# Altium schematic sheet n-MAX-V1.SchDoc
size A4; PageSetup: Record=PageOptions|CenterHorizontal=True|CenterVertical=True|PrintScale=1.00|XCorrection=1.00|YCorrection=1.00|PrintKind=2|BorderSize=5000000|LeftOffset=0|BottomOffset=0|Orientation=2|PaperLength=1000|PaperWidth=1000|Scale=100|PaperSource=7|PrintQuality=-4|MediaType=1|DitherType=10|PaperKind=A4|PrintScaleMode=1
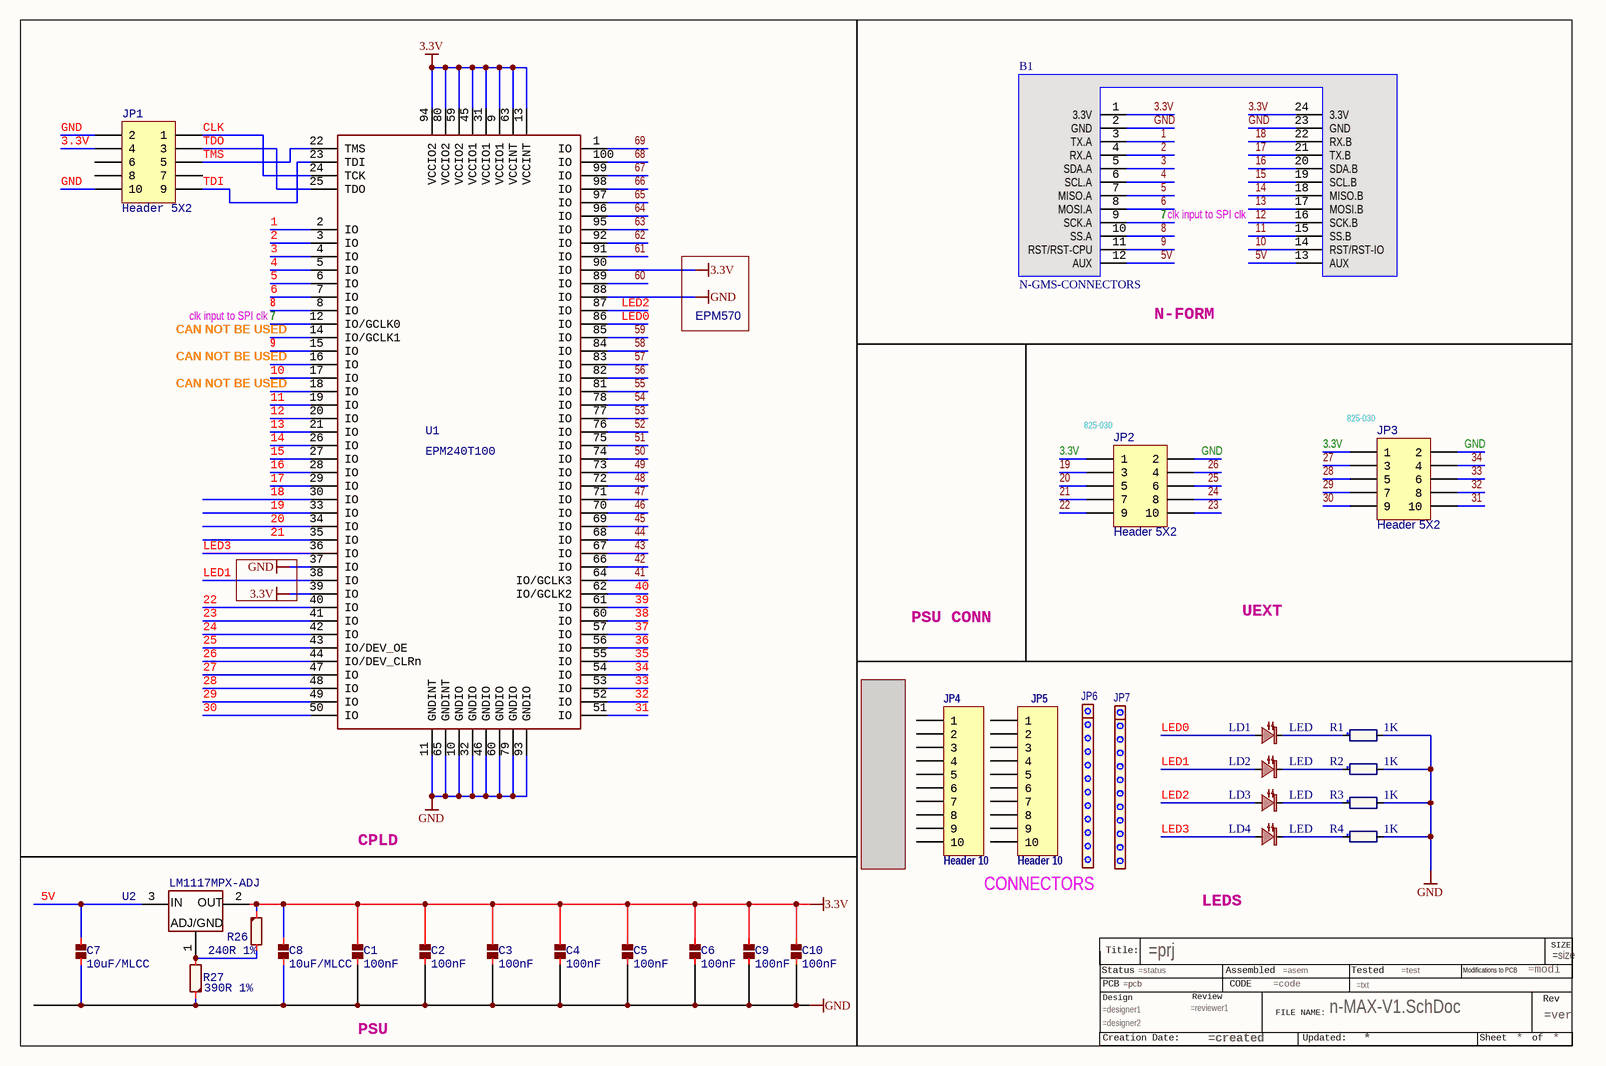
[diagram p0: n-MAX-V1.SchDoc]

## Parts
?*??  FILE_NAME: n-MAX-V1.SchDoc  (hidden comment: TITLEBLOCK3)  (graphical)
B1  N-GMS-CONNECTORS  [N-GMS]
C1  100nF  [0603_CAP]
C2  100nF  [0603_CAP]
C3  100nF  [0603_CAP]
C4  100nF  [0603_CAP]
C5  100nF  [0603_CAP]
C6  100nF  [0603_CAP]
C7  10uF/MLCC  [0603_CAP]
C8  10uF/MLCC  [0603_CAP]
C9  100nF  [0603_CAP]
C10  100nF  [0603_CAP]
JP1  Header 5X2  [ML10-FCI]
JP2  Header 5X2  CODE: 825-030  [ML10-FCI]
JP3  Header 5X2  CODE: 825-030  [ML10-FCI]
JP4  Header 10  [1X10]
JP5  Header 10  [1X10]
JP6  HEADER 9  [1X12-NOSILK]  (value not drawn)
JP7  HEADER 9  [1X12-NOSILK]  (value not drawn)
LD1  LED  [0603_LED_RED]
LD2  LED  [0603_LED_RED]
LD3  LED  [0603_LED_RED]
LD4  LED  [0603_LED_RED]
R1  1K  [0603_res]
R2  1K  [0603_res]
R3  1K  [0603_res]
R4  1K  [0603_res]
R26  240R 1%  [0603_RES]
R27  390R 1%  [0603_RES]
U1  EPM240T100  [TQFP100]
U2  LM1117MPX-ADJ  [SOT-223]

## Nets
3.3V: B1.1(3.3V) B1.24(3.3V) C1.1 C2.1 C3.1 C4.1 C5.1 C6.1 C8.1 C9.1 C10.1 JP1.4 JP2.1 JP3.1 R26.1 U1.9(VCCIO1) U1.13(VCCINT) U1.31(VCCIO1) U1.39(IO) U1.45(VCCIO1) U1.59(VCCIO2) U1.63(VCCINT) U1.80(VCCIO2) U1.90(IO) U1.94(VCCIO2) U2.2(OUT)
GND: B1.2(GND) B1.23(GND) C1.2 C2.2 C3.2 C4.2 C5.2 C6.2 C7.2 C8.2 C9.2 C10.2 JP1.2 JP1.10 JP2.2 JP3.2 R1.2 R2.2 R3.2 R4.2 R27.1 U1.10(GNDIO) U1.11(GNDINT) U1.32(GNDIO) U1.37(IO) U1.46(GNDIO) U1.60(GNDIO) U1.65(GNDINT) U1.79(GNDIO) U1.88(IO) U1.93(GNDIO)
1: B1.3(TX.A) U1.2(IO)
2: B1.4(RX.A) U1.3(IO)
3: B1.5(SDA.A) U1.4(IO)
4: B1.6(SCL.A) U1.5(IO)
5: B1.7(MISO.A) U1.6(IO)
5V: B1.12(AUX) B1.13(AUX) C7.1 U2.3(IN)
6: B1.8(MOSI.A) U1.7(IO)
7: B1.9(SCK.A) U1.12(IO/GCLK0)
8: B1.10(SS.A) U1.8(IO)
9: B1.11(RST/RST-CPU) U1.15(IO)
10: B1.14(RST/RST-IO) U1.17(IO)
11: B1.15(SS.B) U1.19(IO)
12: B1.16(SCK.B) U1.20(IO)
13: B1.17(MOSI.B) U1.21(IO)
14: B1.18(MISO.B) U1.26(IO)
15: B1.19(SCL.B) U1.27(IO)
16: B1.20(SDA.B) U1.28(IO)
17: B1.21(TX.B) U1.29(IO)
18: B1.22(RX.B) U1.30(IO)
19: JP2.3 U1.33(IO)
20: JP2.5 U1.34(IO)
21: JP2.7 U1.35(IO)
22: JP2.9 U1.40(IO)
23: JP2.10 U1.41(IO)
24: JP2.8 U1.42(IO)
25: JP2.6 U1.43(IO/DEV_OE)
26: JP2.4 U1.44(IO/DEV_CLRn)
27: JP3.3 U1.47(IO)
28: JP3.5 U1.48(IO)
29: JP3.7 U1.49(IO)
30: JP3.9 U1.50(IO)
31: JP3.10 U1.51(IO)
32: JP3.8 U1.52(IO)
33: JP3.6 U1.53(IO)
34: JP3.4 U1.54(IO)
35: U1.55(IO)
36: U1.56(IO)
37: U1.57(IO)
38: U1.60(IO)
39: U1.61(IO)
40: U1.62(IO/GCLK2)
41: U1.64(IO/GCLK3)
42: U1.66(IO)
43: U1.67(IO)
44: U1.68(IO)
45: U1.69(IO)
46: U1.70(IO)
47: U1.71(IO)
48: U1.72(IO)
49: U1.73(IO)
50: U1.74(IO)
51: U1.75(IO)
52: U1.76(IO)
53: U1.77(IO)
54: U1.78(IO)
55: U1.81(IO)
56: U1.82(IO)
57: U1.83(IO)
58: U1.84(IO)
59: U1.85(IO)
60: U1.89(IO)
61: U1.91(IO)
62: U1.92(IO)
63: U1.95(IO)
64: U1.96(IO)
65: U1.97(IO)
66: U1.98(IO)
67: U1.99(IO)
68: U1.100(IO)
69: U1.1(IO)
CLK: JP1.1 U1.24(TCK)
LED0: LD1.1(A) U1.86(IO)
LED1: LD2.1(A) U1.38(IO)
LED2: LD3.1(A) U1.87(IO)
LED3: LD4.1(A) U1.36(IO)
TDI: JP1.9 U1.23(TDI)
TDO: JP1.3 U1.25(TDO)
TMS: JP1.5 U1.22(TMS)
NetLD1_2: LD1.2(C) R1.1
NetLD2_2: LD2.2(C) R2.1
NetLD3_2: LD3.2(C) R3.1
NetLD4_2: LD4.2(C) R4.1
NetR26_2: R26.2 R27.2 U2.1(ADJ/GND)

Not connected (* = marked no-connect by the designer): ?*?? ?1; JP1 6 7 8; JP4 1 2 3 4 5 6 7 8 9 10; JP5 1 2 3 4 5 6 7 8 9 10; JP6 1 2 3 4 5 6 7 8 9 10 11 12; JP7 1 2 3 4 5 6 7 8 9 10 11 12; U1 14(IO/GCLK1) 16(IO) 18(IO)

## Notes on the sheet
- (near B1) clk input to SPI clk
- (near U1) clk input to SPI clk
- EPM570
- (near B1) N-FORM
- CAN NOT BE USED
- PSU CONN
- UEXT
- CPLD
- (near JP6) CONNECTORS
- LEDS
- PSU
- (in symbol TITLEBLOCK3) SIZE; Title:; Status; Assembled; Tested; Modifications to PCB; PCB; CODE; Design; Review; Rev; FILE NAME:; Creation Date:; Updated:; Sheet; of

## Library data of the parts
B1 = N-GMS-CONNECTORS: Divider: 1
C1-C6 C9 C10 = C: CAPACITOR; Manufacturer: Kemet; Manufacturer Part Number: C0603C104K5RACAUTO; S.Description: Multilayer Ceramic Capacitors MLCC - SMD/SMT 0.1uF 50volts 10% X7R AUTO; Capacitance: 0.1 uF; S.Footprint: 0603 (1608 metric); Tolerance: 10 %; Type: AEC-Q200; Voltage Rating DC: 50 VDC; Capacitance - pF: 100000 pF; Class: Class 1; Dielectric: X7R; Divider: 1; Supplier 1: Mouser; Supplier Part Number 1: 80-C0603C104K5RAUTO; RoHS: RoHS Compliant; Category: Multilayer Ceramic Capacitors MLCC - SMD/SMT; Stock 1: 388828; Pricing 1: 1=0.094, 10=0.033, 100=0.023, 500=0.019, 1000=0.015, 4000=0.011, 8000=0.009, 48000=0.007 (EUR); Height: -; Length: 1.6 mm; Packaging: Reel; Product: Automotive MLCCs; Series: C0603C; Termination Style: SMD/SMT; Voltage Rating AC: -; Width: 0.8 mm; Brand: Kemet; Capacitance - nF: 100 nF; Case Code - in: 0603; Case Code - mm: 1608; Maximum Operating Temperature: + 125 C; Minimum Operating Temperature: - 55 C; Qualification: AEC-Q200; Standard Pack Qty: 4000; RoHS - Mouser: Y; Minimum Order Quantity: 1; Reeling: True; ComponentLink1URL: http://www.mouser.com/ds/2/212/KEM_C1023_X7R_AUTO_SMD-519505.pdf; ComponentLink1Description: http://www.mouser.com/ds/2/212/KEM_C1023_X7R_AUTO_SMD-519505.pdf
C7 C8 = C: CAPACITOR; Manufacturer: Murata Electronics; Manufacturer Part Number: GRM188R60J106ME47D; S.Description: Multilayer Ceramic Capacitors MLCC - SMD/SMT 0603 10uF 6.3volts X5R 20%; Capacitance: 10 uF; S.Footprint: 0603 (1608 metric); Tolerance: 20 %; Type: General Purpose MLCC; Voltage Rating DC: 6.3 VDC; Dielectric: X5R; Qualification: Commercial; Divider: 1; Supplier 1: Mouser; Supplier Part Number 1: 81-GRM188R60J106ME47; RoHS: RoHS Compliant; Category: Multilayer Ceramic Capacitors MLCC - SMD/SMT; Stock 1: 1017745; Pricing 1: 1=0.141, 10=0.057, 100=0.040, 500=0.033, 1000=0.026, 4000=0.022 (EUR); Height: 0.8 mm; Length: 1.6 mm; Packaging: Reel; Product: General Type MLCCs; Series: GRM; Termination Style: SMD/SMT; Width: 0.8 mm; Brand: Murata Electronics; Case Code - in: 0603; Case Code - mm: 1608; Maximum Operating Temperature: + 85 C; Minimum Operating Temperature: - 55 C; Standard Pack Qty: 4000; RoHS - Mouser: Y; Minimum Order Quantity: 1; Reeling: True; ComponentLink1URL: http://www.mouser.com/ds/2/281/c02e-2905.pdf; ComponentLink1Description: http://www.mouser.com/ds/2/281/c02e-2905.pdf
JP1-JP3 = Header 5X2: Header, 5-Pin, Dual row; Manufacturer: Amphenol FCI; Manufacturer Part Number: 66506-001LF; S.Description: Headers & Wire Housings 10POS 2X5 HDR; Mounting Angle: Vertical; Number of Positions: 10 Position; Pitch: 2.54 mm; Mating Post Length: 5.84 mm; Divider: 1; Revision: 17-Jul-2002: Re-released for DXP Platform.; Supplier 1: Mouser; Supplier Part Number 1: 649-66506-001LF; RoHS: RoHS Compliant; Category: Headers & Wire Housings; Stock 1: 1794; Pricing 1: 1=1.16, 10=0.962, 100=0.882, 250=0.802, 500=0.721, 1000=0.641, 2500=0.581, 5000=0.561, 10000=0.533 (EUR); Contact Plating: Gold; Housing Material: Thermoplastic; Number of Rows: 2 Row; Packaging: Tray; Product: Headers; Series: Quickie; Termination Style: Through Hole; Type: Shrouded; Brand: Amphenol FCI; Contact Material: Phosphor Bronze; Mounting Style: -; Contact Gender: Pin (Male); Standard Pack Qty: 50; Termination Post Length: 2.67 mm; Tradename: Quickie; RoHS - Mouser: Y; Minimum Order Quantity: 1; Reeling: False; ComponentLink1URL: http://www.mouser.com/ds/2/18/bus-12-082-946233.pdf; ComponentLink1Description: http://www.mouser.com/ds/2/18/bus-12-082-946233.pdf
  JP1: Publisher: Altium Limited
  JP2 JP3: MOUSER: 825-030
JP4 JP5 = Header 10: Header, 10-Pin; S.Description: Headers & Wire Housings 10 PIN SIL VERTICAL GOLD+TIN SOCKET; Divider: 1; Revision: 17-Jul-2002: Re-released for DXP Platform.; Supplier 1: Mouser; Supplier Part Number 1: 855-M22-7131042
JP6 JP7 = HDR12: Divider: 0.25; S.Description: Headers & Wire Housings 50P SINGLE ROW; Supplier 1: Mouser; Supplier Part Number 1: 571-5-825433-0
LD1-LD4 = LED: Manufacturer: OSRAM Opto Semiconductors; Manufacturer Part Number: LS Q976-NR-1; S.Description: Standard LEDs - SMD Super Red, 633nm 180mcd, 20mA; Illumination Color: Red; Lens Color/Style: Colorless Diffused; S.Footprint: 0603; Type: Uni-Color; Wavelength: 633 nm; LED Size: 1.6 mm x 0.8 mm; Lens Shape: Rectangular; Luminous Intensity: 180 mcd; Peak Wavelength: 645 nm; Viewing Angle: 160 deg; If - Forward Current: 25 mA; Vf - Forward Voltage: 2.5 V; Divider: 1; Supplier 1: Mouser; Supplier Part Number 1: 720-LSQ976-NR-1; RoHS: RoHS Compliant; Category: Standard LEDs - SMD; Stock 1: 114651; Pricing 1: 1=0.245, 10=0.138, 100=0.066, 500=0.058, 1000=0.046, 2000=0.041, 4000=0.036, 8000=0.032, 24000=0.031 (EUR); Height: 0.9 mm; Length: 1.7 mm; Packaging: Reel; Series: CHIPLED 0603; Width: 0.9 mm; Brand: OSRAM Opto Semiconductors; Mounting Style: SMD/SMT; Color Temperature: -; Maximum Operating Temperature: + 85 C; Minimum Operating Temperature: - 30 C; Standard Pack Qty: 4000; Wavelength/Color Temperature: 633 nm; RoHS - Mouser: Y; Minimum Order Quantity: 1; Reeling: True; ComponentLink1URL: http://www.mouser.com/ds/2/311/LS Q976 - CHIPLED 0603-741036.pdf; ComponentLink1Description: http://www.mouser.com/ds/2/311/LS Q976 - CHIPLED 0603-741036.pdf
R1-R4 = R: RESISTOR; Manufacturer: Vishay; Manufacturer Part Number: CRCW06031K00FKEA; S.Description: Thick Film Resistors - SMD 1/10watt 1.0Kohms 1%; S.Footprint: 0603 (1608 metric); Power Rating: 100 mW; Resistance: 1 kOhms; Temperature Coefficient: 100 PPM / K; Tolerance: 1 %; Voltage Rating: 75 V; Qualification: Commercial; Divider: 1; Supplier 1: Mouser; Supplier Part Number 1: 71-CRCW0603-1.0K-E3; RoHS: RoHS Compliant By Exemption; Category: Thick Film Resistors - SMD; Stock 1: 674900; Pricing 1: 1=0.094, 10=0.041, 100=0.025, 500=0.020, 1000=0.017, 5000=0.006, 25000=0.005, 50000=0.004 (EUR); Features: Metal glaze on high quality ceramic; Height: 0.45 mm; Length: 1.55 mm; Operating Temperature Range: - 55 C to + 155 C; Packaging: Reel; Product: Thick Film Resistors SMD; Series: CRCW e3; Termination Style: SMD/SMT; Width: 0.85 mm; Brand: Vishay; Case Code - in: 0603; Case Code - mm: 1608; Standard Pack Qty: 5000; RoHS - Mouser: E; Minimum Order Quantity: 1; Reeling: True; ComponentLink1URL: http://www.mouser.com/ds/2/427/dcrcwe3-109170.pdf; ComponentLink1Description: http://www.mouser.com/ds/2/427/dcrcwe3-109170.pdf
R26 = R: RESISTOR; Manufacturer: Panasonic; Manufacturer Part Number: ERJ-3EKF2400V; OLIMEX: OLIMEX#33 RES 0805 10 K 5%; S.Description: Thick Film Resistors - SMD 0603 240ohms 1% AEC-Q200; S.Footprint: 0603 (1608 metric); Power Rating: 100 mW; Resistance: 240 Ohms; Voltage Rating: 75 V; Qualification: AEC-Q200; Divider: 1; Supplier 1: Mouser; Supplier Part Number 1: 667-ERJ-3EKF2400V; RoHS: RoHS Compliant By Exemption; Category: Thick Film Resistors - SMD; Stock 1: 126186; Pricing 1: 1=0.141, 10=0.013, 100=0.006, 1000=0.004, 5000=0.002 (EUR); Height: 0.45 mm; Length: 1.6 mm; Operating Temperature Range: - 55 C to + 155 C; Packaging: Reel; Product: Thick Film Resistors SMD; Series: ERJ; Termination Style: SMD/SMT; Tolerance: 1 %; Type: Precision Thick Film Resistors SMD; Width: 0.8 mm; Brand: Panasonic; Case Code - in: 0603; Case Code - mm: 1608; Standard Pack Qty: 5000; RoHS - Mouser: E; Minimum Order Quantity: 1; Reeling: True; ComponentLink1URL: http://www.mouser.com/ds/2/315/AOA0000C86-911473.pdf; ComponentLink1Description: http://www.mouser.com/ds/2/315/AOA0000C86-911473.pdf
R27 = R: RESISTOR; Manufacturer: Vishay / Beyschlag; Manufacturer Part Number: MCT06030C3900FP500; S.Description: Thin Film Resistors - SMD .1W 390ohm 1% 0603 50ppm Auto; S.Footprint: 0603 (1608 metric); Power Rating: 100 mW; Resistance: 390 Ohms; Temperature Coefficient: 50 PPM / K; Voltage Rating: 75 V; Divider: 1; Supplier 1: Mouser; Supplier Part Number 1: 594-MCT06030C3900FP5; RoHS: RoHS Compliant; Category: Thin Film Resistors - SMD; Stock 1: 10472; Pricing 1: 1=0.094, 50=0.043, 100=0.033, 500=0.022, 5000=0.019 (EUR); Height: 0.45 mm; Length: 1.6 mm; Operating Temperature Range: - 55 C to + 125 C; Packaging: Reel; Product: Professional Resistors Thin Film SMD; Series: MCx - Professional; Termination Style: SMD/SMT; Tolerance: 1 %; Type: Professional Thin Film Chip Resistors; Width: 0.8 mm; Brand: Vishay / Beyschlag; Case Code - in: 0603; Case Code - mm: 1608; Standard Pack Qty: 5000; RoHS - Mouser: Y; Minimum Order Quantity: 1; Reeling: True; ComponentLink1URL: http://www.mouser.com/ds/2/427/mcx0x0xpro-223600.pdf; ComponentLink1Description: http://www.mouser.com/ds/2/427/mcx0x0xpro-223600.pdf
U1 = EPM240T100: Manufacturer: Altera; Manufacturer Part Number: EPM240T100C5N; S.Description: CPLD - Complex Programmable Logic Devices CPLD - MAX II 192 Macro 80 IOs; Memory Type: Flash; S.Footprint: TQFP-100; Number of I/Os: 80 I/O; Number of Macrocells: 192; Propagation Delay - Max: 4.7 ns; Maximum Operating Frequency: 304 MHz; Number of Logic Array Blocks - LABs: 24; Number of Logic Elements: 240; Operating Supply Current: 55 mA; Operating Supply Voltage: 2.5 V, 3.3 V; Supply Voltage - Max: 3.6 V; Supply Voltage - Min: 2.375 V; Total Memory: 8192 bit; Divider: 1; Supplier 1: Mouser; Supplier Part Number 1: 989-EPM240T100C5N; RoHS: RoHS Compliant; Category: CPLD - Complex Programmable Logic Devices; Stock 1: 589; Pricing 1: 1=7.07 (EUR); Packaging: Tray; Product: MAX II; Series: EPM240 MAX II; Brand: Altera; Mounting Style: SMD/SMT; Maximum Operating Temperature: + 70 C; Minimum Operating Temperature: 0 C; Standard Pack Qty: 90; Tradename: MAX II; RoHS - Mouser: Y; Minimum Order Quantity: 1; Reeling: False; ComponentLink1URL: http://www.mouser.com/ds/2/591/max2_mii5v1-472974.pdf; ComponentLink1Description: http://www.mouser.com/ds/2/591/max2_mii5v1-472974.pdf
U2 = LM1117: REGULATOR LOW DROPOUT; Manufacturer: Texas Instruments; Manufacturer Part Number: LM1117MP-ADJ/NOPB; S.Description: LDO Voltage Regulators 800MA LDO LINEAR REG; Input Voltage MAX: 15 V; Number of Outputs: 1 Output; Output Current: 1.5 A; Output Type: Adjustable; Output Voltage: 1.25 V to 13.8 V; S.Footprint: SOT-223-4; Dropout Voltage - Max: 1.2 V at 100 mA, 1.25 V at 500 mA, 1.3 V at 800 mA; Voltage Regulation Accuracy: +/- 1 %; Dropout Voltage: 1.1 V at 100 mA, 1.15 V at 500 mA, 1.2 V at 800 mA; Ib - Input Bias Current: 5 mA; Line Regulation: 0.04 %; Load Regulation: 0.2 %; Polarity: Positive; Reference Voltage: 1.262 V; Divider: 1; Supplier 1: Mouser; Supplier Part Number 1: 926-LM1117MP-ADJNOPB; RoHS: RoHS Compliant; Category: LDO Voltage Regulators; Stock 1: 2171; Pricing 1: 1=0.943, 10=0.805, 100=0.619, 500=0.547, 1000=0.432, 2000=0.381, 10000=0.374 (EUR); Packaging: Reel; Series: LM1117-N; Brand: Texas Instruments; Mounting Style: SMD/SMT; Maximum Operating Temperature: + 125 C; Minimum Operating Temperature: 0 C; Standard Pack Qty: 1000; RoHS - Mouser: Y; Minimum Order Quantity: 1; Reeling: True
?*?? = TITLEBLOCK3: size: =size; CREATION DATE: =created; UPDATED: *; PAGE NUMPER: *; PAGE COUNT: *; VERSION: =ver; pr: =prj; ASSEMBLY: =asem; MODIFICATIONS TO OPERATE: =modi; TESTED: =test; PCB: =pcb; STATUS: =status; CODE: =code; TEXT: =txt; designer1: =designer1; designer2: =designer2; reviewer1: =reviewer1